# EAGLE design MaxAir Smart Home Gateway WT21-ET01 - v092 (EAGLE 9.6.2)
PiHome - Smart Heating, Ventilation and Air Conditioning (HVAC) Wi-Fi Smart Home Gateway based on MySensors library with NodeMCU and nRF24L01 PA LNA Note: Power by micro USB with minimum 2amp for better performance. For more information on PiHome Smart Heating: http://www.pihome.eu
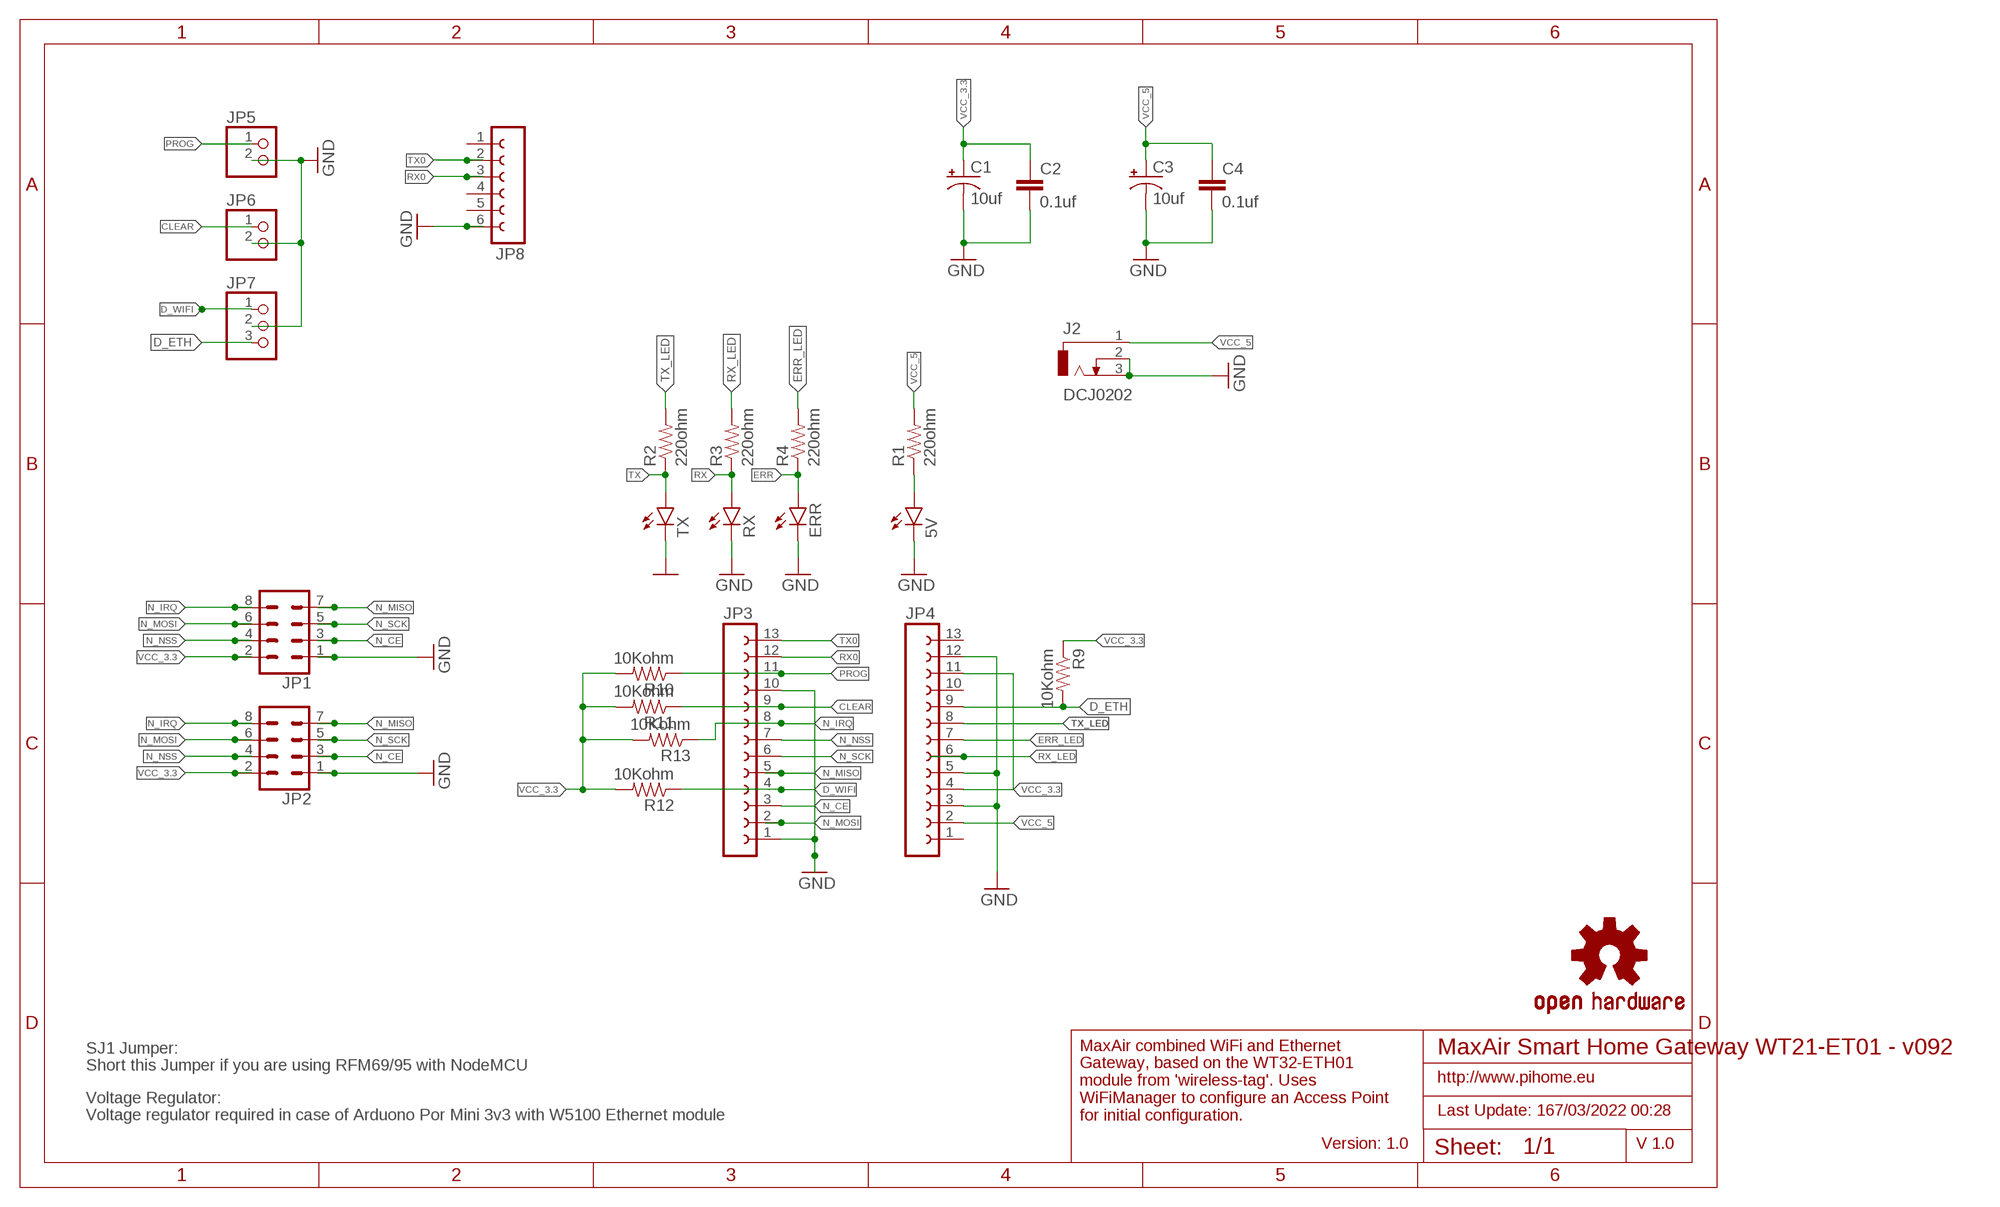
[diagram p0: schematic, sheet 1]

## Parts
5V  LED3MM  [LED3MM]
C1  10uf  10UF-25V-20%(PTH)KIT  [CPOL-RADIAL-10UF-25V-KIT]
C2  0.1uf  0.1UF-50V-20%(PTH)KIT-EZ  [CAP-PTH-SMALL-KIT]
C3  10uf  10UF-25V-20%(PTH)KIT  [CPOL-RADIAL-10UF-25V-KIT]
C4  0.1uf  0.1UF-50V-20%(PTH)KIT-EZ  [CAP-PTH-SMALL-KIT]
ERR  LED3MM  [LED3MM]
J2  DCJ0202  [DCJ0202]
JP1  CONN_04X2  [2X4]
JP2  CONN_04X2  [2X4]
JP3  FE13-1  [FE13]
JP4  FE13-1  [FE13]
JP5  PINHD-1X2  [1X02]
JP6  PINHD-1X2  [1X02]
JP7  PINHD-1X3  [1X03]
JP8  FE06-1  [FE06]
LOGO1  OSHW-LOGOMINI  [OSHW-LOGO-MINI]
R1  220ohm  RESISTORAXIAL-0.3  [AXIAL-0.3]
R2  220ohm  RESISTORAXIAL-0.3  [AXIAL-0.3]
R3  220ohm  RESISTORAXIAL-0.3  [AXIAL-0.3]
R4  220ohm  RESISTORAXIAL-0.3  [AXIAL-0.3]
R9  10Kohm  RESISTORAXIAL-0.3  [AXIAL-0.3]
R10  10Kohm  RESISTORAXIAL-0.3  [AXIAL-0.3]
R11  10Kohm  RESISTORAXIAL-0.3  [AXIAL-0.3]
R12  10Kohm  RESISTORAXIAL-0.3  [AXIAL-0.3]
R13  10Kohm  RESISTORAXIAL-0.3  [AXIAL-0.3]
RX  LED3MM  [LED3MM]
TX  LED3MM  [LED3MM]

## Nets
CLEAR: JP3.9 JP6.1 R11.P$1
D_ETH: JP4.9 JP7.3 R9.P$2
D_WIFI: JP3.4 JP7.1 R12.P$1
ERR: ERR.A R4.P$1
ERR_LED: JP4.7 R4.P$2
GND: 5V.K(C) C1.2(-) C2.2 C3.2(-) C4.2 ERR.K(C) J2.2 J2.3 JP1.1 JP2.1 JP3.1 JP3.10 JP4.3 JP4.5 JP4.12 JP5.2 JP6.2 JP7.2 JP8.6 RX.K(C) TX.K(C)
N$1: 5V.A R1.P$1
N_CE: JP1.3 JP2.3 JP3.3
N_IRQ: JP1.8 JP2.8 JP3.8 R13.P$1
N_MISO: JP1.7 JP2.7 JP3.5
N_MOSI: JP1.6 JP2.6 JP3.2
N_NSS: JP1.4 JP2.4 JP3.7
N_SCK: JP1.5 JP2.5 JP3.6
PROG: JP3.11 JP5.1 R10.P$1
RX: R3.P$1 RX.A
RX0: JP3.12 JP8.3
RX_LED: JP4.6 R3.P$2
TX: R2.P$1 TX.A
TX0: JP3.13 JP8.2
TX_LED: JP4.8 R2.P$2
VCC_3.3: C1.1(+) C2.1 JP1.2 JP2.2 JP4.4 JP4.11 R9.P$1 R10.P$2 R11.P$2 R12.P$2 R13.P$2
VCC_5: C3.1(+) C4.1 J2.1 JP4.2 R1.P$2
Unconnected: JP4.1 JP4.10 JP4.13 JP8.1 JP8.4 JP8.5

## Notes on the sheet
- SJ1 Jumper:
  Short this Jumper if you are using RFM69/95 with NodeMCU
- http://www.pihome.eu
- Last Update: 167/03/2022 00:28
- Voltage Regulator:
  Voltage regulator required in case of Arduono Por Mini 3v3 with W5100 Ethernet module
- MaxAir combined WiFi and Ethernet
  Gateway, based on the WT32-ETH01
  module from 'wireless-tag'. Uses
  WiFiManager to configure an Access Point
  for initial configuration.
- Version: 1.0 | V 1.0

## Library data of the parts
5V ERR RX TX = SparkFun-LED:LED: LEDs Standard schematic elements and footprints for 5mm, 3mm, 1206, and 0603 sized LEDs. 5mm - Spark Fun Electronics SKU : COM-00529 (and others); PROD_ID: DIO-08794
C1 C3 = SparkFun-Capacitors:10UF-25V-20%(PTH): CAP-08440; PROD_ID: CAP-08440
C2 C4 = SparkFun-Capacitors:0.1UF-50V-20%(PTH): CAP-08370; PROD_ID: CAP-08370
J2 = con-jack:DCJ0202: DC POWER JACK Source: DCJ0202.pdf; OC_FARNELL: unknown; OC_NEWARK: unknown
JP1 JP2 = SparkFun-Connectors:CONN_04X2: Multi connection point. Often used as Generic Header-pin footprint for 0.1 inch spaced/style header connections On any of the 0.1 inch spaced packages, you can populate with these: Break Away Headers - Straight <https://www.sparkfun.com/products/116> (PRT-00116) Break Away Male Headers - Right Angle <https://www.sparkfun.com/products/553> (PRT-00553) Female Headers <https://www.sparkfun.com/products/115> (PRT-00115) Break Away Headers - Machine Pin <https://www.sparkfun.com/products/117> (PRT-00117) Break Away Female Headers - Swiss Machine Pin <https://www.sparkfun.com/products/743> (PRT-00743)
JP3 JP4 = con-lsta:FE13-1: FEMALE HEADER; OC_FARNELL: unknown; OC_NEWARK: unknown
JP5 JP6 = pinhead:PINHD-1X2: PIN HEADER
JP7 = pinhead:PINHD-1X3: PIN HEADER
JP8 = con-lsta:FE06-1: FEMALE HEADER; OC_FARNELL: unknown; OC_NEWARK: unknown
LOGO1 = SparkFun-Aesthetics@1:OSHW-LOGO: Open-Source Hardware (OSHW) Logo This logo indicates the piece of hardware it is found on incorporates a OSHW license and/or adheres to the definition of open source hardware found here: http://freedomdefined.org/OSHW
R1-R4 R9-R13 = SparkFun-Passives:RESISTOR: Resistor Basic schematic elements and footprints for 0603, 1206, and PTH resistors.

## Net classes
0 default: width 0.254 mm, drill 0.076 mm, clearance 0.205 mm

## Board
PiHome - Smart Heating, Ventilation and Air Conditioning (HVAC) Wi-Fi Smart Home Gateway based on MySensors library with NodeMCU and nRF24L01 PA LNA Note: Power by micro USB with minimum 2amp for better performance. For more information on PiHome Smart Heating: http://www.pihome.eu
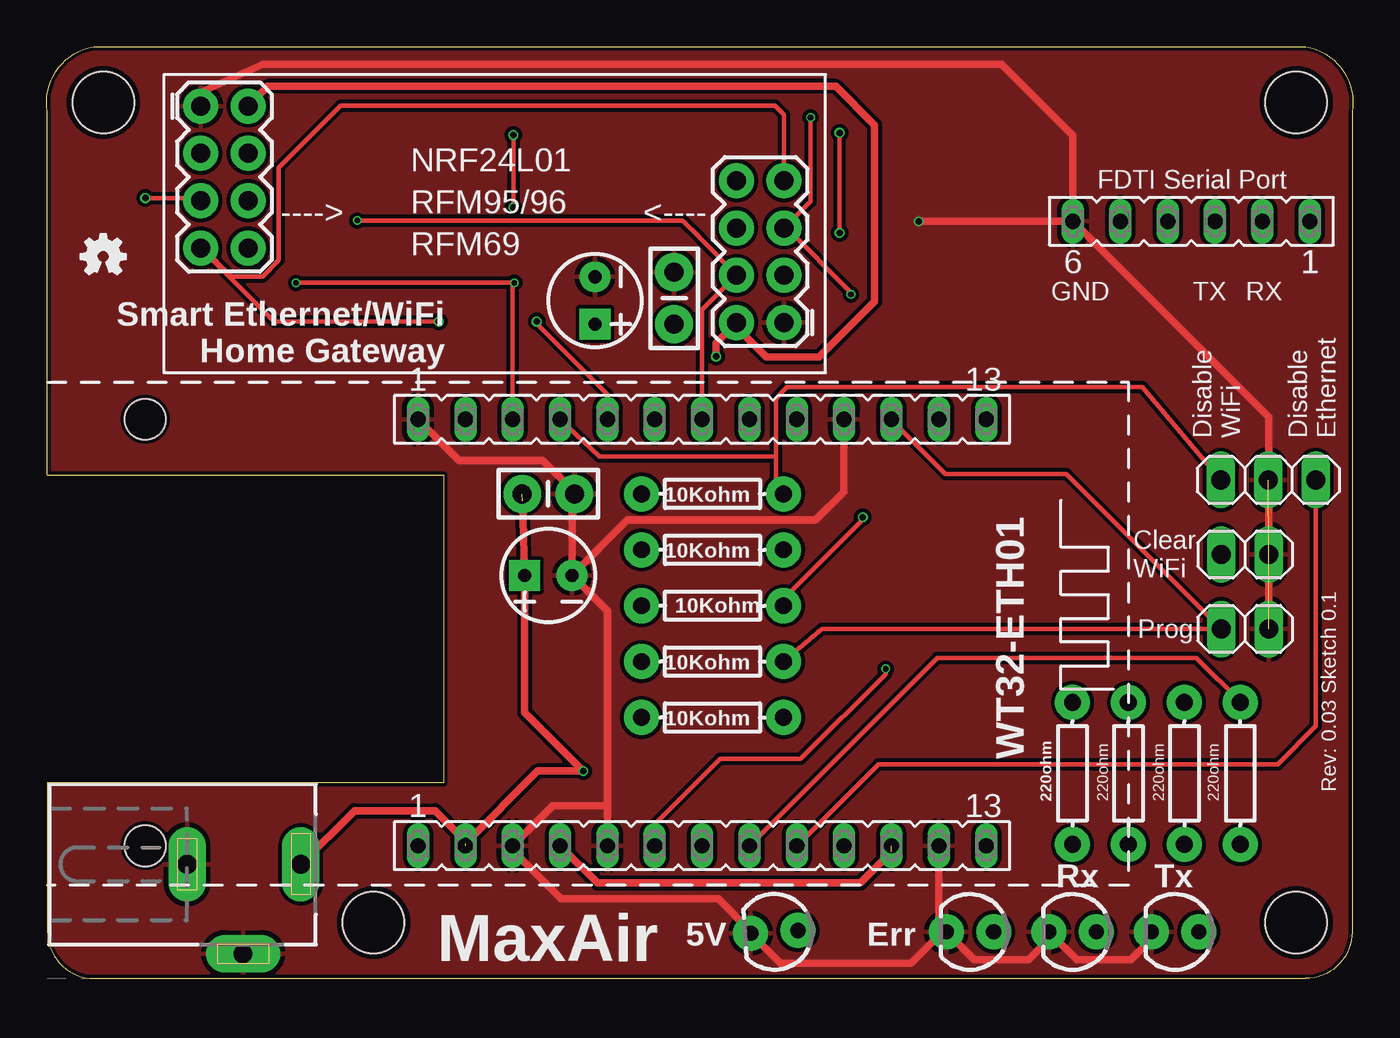
[diagram p1: board, top side]
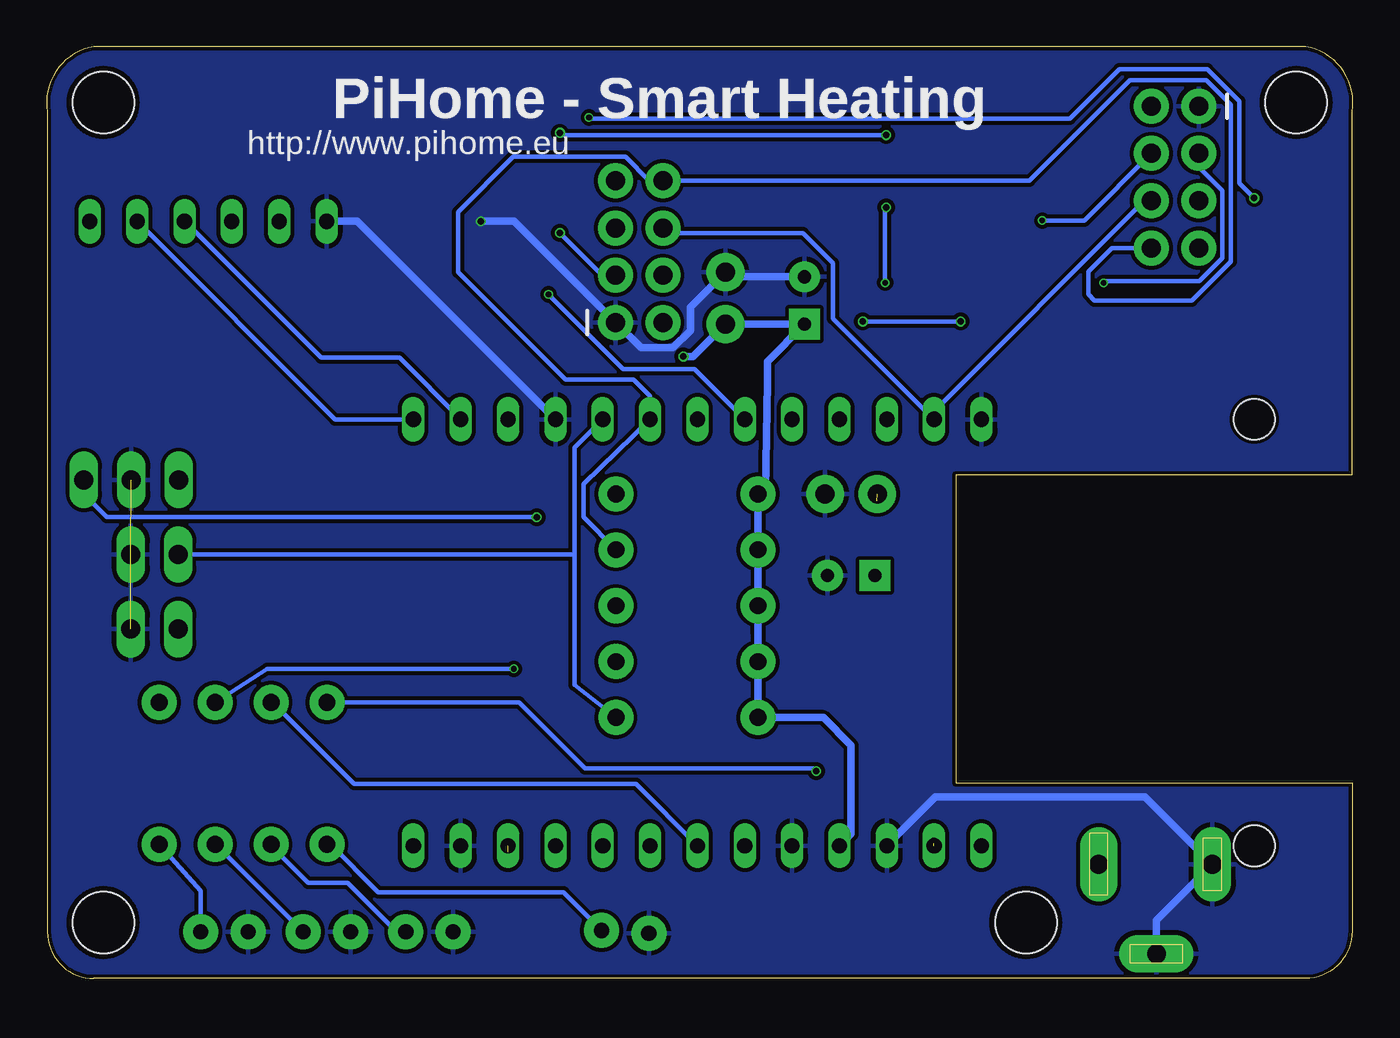
[diagram p2: board, bottom side, seen from below]

Size 70.08 x 50 mm. Coordinates in mm from the lower left corner, seen from the top.
Outline: 2.54,0 67.54,0 arc90 70.04,2.5 70.04,46.5 arc90 67.54,50 2.54,50 arc90 0.04,46.5 0.04,27 21.29,27 21.29,10.5 0.04,10.5 0.04,2.55 arc90 2.54,0
Copper layers (1*16): Top 0.035559375mm / dielectric 1.6mm / Bottom 0.035559375mm
Design rules "PiHome - JLCPCB 2 Layer": minimum track width 5mil, minimum drill 12mil, track to track 5mil, track to pad 5mil, pad to pad 5mil, via to via 5mil, smd to smd 5mil, copper to edge 8mil, drill to drill 6mil, minimum pad ring 5mil, minimum via ring 3mil, stop-mask expansion 2.5mil, vias tented up to drill 0mil, thermal gap 10mil
Holes 2.2 mm at 5.29,30 5.29,7.12

### Footprints (pad centres in the part's own frame; a part is rotated, then mirrored left to right if it is on the bottom)
LED3MM = drill 0.813 pad 1.88: A -1.27,0; K 1.27,0
CPOL-RADIAL-10UF-25V-KIT = drill 0.7 pad 1.651 square: 1 1.27,0 | drill 0.7 pad 1.651: 2 -1.27,0
CAP-PTH-SMALL-KIT = drill 1.016 pad 2.032: 1 -1.397,0; 2 1.397,0
DCJ0202 = drill 1 pad 2 long: 1 0,3.1; 2 4.8,0; 3 0,-3
2X4 = drill 1.016 pad 1.88: 1 -3.81,-1.27; 2 -3.81,1.27; 3 -1.27,-1.27; 4 -1.27,1.27; 5 1.27,-1.27; 6 1.27,1.27; 7 3.81,-1.27; 8 3.81,1.27
FE13 = drill 0.813 long: 1 -15.24,0; 2 -12.7,0; 3 -10.16,0; 4 -7.62,0; 5 -5.08,0; 6 -2.54,0; 7 0,0; 8 2.54,0; 9 5.08,0; 10 7.62,0; 11 10.16,0; 12 12.7,0; 13 15.24,0
1X02 = drill 1.016 long: 1 -1.27,0; 2 1.27,0
1X03 = drill 1.016 long: 1 -2.54,0; 2 0,0; 3 2.54,0
FE06 = drill 0.813 long: 1 -6.35,0; 2 -3.81,0; 3 -1.27,0; 4 1.27,0; 5 3.81,0; 6 6.35,0
AXIAL-0.3 = drill 0.9 pad 1.88: P$1 -3.81,0; P$2 3.81,0
STAND-OFF = hole 3.302: 0,0

### Placement (x,y rotation side)
5V  39.04,2.5 183.3 top
C1  29.42,36.38 270 top
C2  33.67,36.5 90 top
C3  26.92,21.62 180 top
C4  26.92,26 0 top
ERR  49.54,2.5 180 top
J2  10.54,6.12 270 top
JP1  38.29,39 90 top
JP2  9.54,43 270 top
JP3  35.17,30 0 top
JP4  35.17,7.12 0 top
JP5  64.29,18.75 0 top
JP6  64.29,22.75 0 top
JP7  65.54,26.75 0 top
JP8  61.42,40.62 180 top
LOGO1  3.04,38.75 0 top
R1  55.04,11 90 top
R2  64.04,11 90 top
R3  61.04,11 90 top
R4  58.04,11 90 top
R9  35.73,20 0 top
R10  35.73,17 180 top
R11  35.73,14 180 top
R12  35.73,26 180 top
R13  35.73,23 180 top
RX  55.04,2.5 180 top
TX  60.54,2.5 180 top
U$1  [STAND-OFF]  3.04,47 0 top
U$2  [STAND-OFF]  17.54,3 0 top
U$4  [STAND-OFF]  67.04,47 0 top
U$5  [STAND-OFF]  67.04,3 0 top

### Tracks (layer width: path | path; a pad name or v marks a point on that pad's centre or on a via)
CLEAR
  Bottom 0.254: JP6.1 43.32,22.75 | 43.32,22.75 | 41.75,22.75 41.75,26.36 41.75,26.55 41.75,28.5 JP3.9 | 41.75,22.75 41.75,15.75 R11.P$1 | 43.32,22.75 41.75,22.75
D_ETH  (via drill 0.35)
  Top 0.254: v43.79,24.75 43.79,24.62 39.54,20.37 R9.P$2 | JP4.9 44.62,11.5 66.04,11.5 68.08,13.54 JP7.3 68.17,26.66
  Bottom 0.254: v43.79,24.75 43.81,24.77 66.87,24.77 68.08,25.98 JP7.3
D_WIFI
  Top 0.254: 39.12,28 39.12,31.11 39.73,31.73 58.79,31.73 JP7.1 | 39.12,28 39.12,26.61 R12.P$1 | JP3.4 29.67,28 39.12,28
ERR
  Bottom 0.254: ERR.A 51.31,2.5 53.94,5.12 56.04,5.12 58.01,7.1 R4.P$1
ERR_LED
  Bottom 0.254: JP4.7 38.47,10.43 53.59,10.43 57.96,14.81 R4.P$2
GND  (via drill 0.35)  (2 unrouted)
  Top 0.406: JP2.1 8.27,47.56 11.63,49.06 51.23,49.06 55.07,45.23 55.07,40.88 | C3.2 28.19,25.63 C4.2 28.31,26.09 26.61,27.8 22.13,27.8 JP3.1 | C3.2 31.15,24.59 41.26,24.59 42.79,26.11 JP3.10 | JP4.5 30.09,9.25 | 30.09,9.25 30.09,19.73 C3.2 | 55.07,40.88 JP8.6 65.56,30.13 JP5.2 | ERR.K 48.27,2.71 46.38,0.82 39.38,0.82 5V.K 37.77,2.54 36.05,4.26 27.61,4.26 25.01,6.87 JP4.3 27.13,9.25 30.09,9.25 | JP4.12 47.87,2.9 ERR.K | v46.79,40.62 54.82,40.62 55.07,40.88 | ERR.K 49.77,1 52.67,1 53.77,2.1 RX.K 55.27,1 58.17,1 59.27,2.1 TX.K
  Bottom 0.406: v46.79,40.62 45,40.62 JP1.1 38.2,33.84 36.46,33.84 35.55,34.76 35.55,36.02 C2.2 33.41,37.65 C1.2 | JP4.3 25.01,7.13 22.39,9.75 11.17,9.75 J2.3 10.54,3.12 J2.2 | JP3.10 53.41,40.62 JP8.6
  pour Top: 0.29,0.25 0.29,10.25 21.54,10.25 21.54,27.25 0.29,27.25 0.29,49.75 69.79,49.75 69.79,0.25
  pour Bottom: 0.29,0.25 69.79,0.25 69.79,49.75 0.29,49.75 0.29,27.25 21.54,27.25 21.54,10.25 0.29,10.25
N$1
  Bottom 0.254: 5V.A 42.36,4.62 52.29,4.62 54.85,7.19 R1.P$1
N_CE  (via drill 0.3, 0.35)
  Top 0.254: v25.1,37.33 | v25.1,37.33 13.64,37.33 v13.38,37.32 | JP3.3 25.01,37.24 v25.1,37.33 | v25.04,41.38 v25.04,45.25 | v42.54,45.38 v42.54,40
  Bottom 0.254: v13.38,37.32 13.28,37.42 8.24,37.42 7,38.66 7,42.26 8.27,43.53 JP2.3 | v25.1,37.33 25.1,41.32 v25.04,41.38 | v42.54,45.38 42.42,45.25 v25.04,45.25 | v42.54,40 40.27,37.73 JP1.3
N_IRQ
  Bottom 0.254: R13.P$1 41.29,24.77 41.29,26.54 JP3.8 37.71,31.25 38.58,32.12 42.24,32.12 48.01,37.89 48.01,41.12 45.05,44.08 39.03,44.08 37.76,42.81 JP1.8 17.36,42.81 11.96,48.21 7.87,48.21 6.54,46.88 6.54,38.47 8.63,36.38 13.86,36.38 14.19,36.71 14.19,37.92 12.92,39.19 JP2.8
N_MISO  (via drill 0.35)
  Top 0.254: JP1.7 39.56,46.35 39.09,46.83 15.78,46.83 12.46,43.51 12.46,38.54 11.59,37.67 9.91,37.67 8.39,39.19 JP2.7 12.21,35.25 v21.04,35.25 | v26.29,35.25 26.29,35.12 30.09,31.33 JP3.5
  Bottom 0.254: v21.04,35.25 v26.29,35.25
N_MOSI
  Bottom 0.254: JP3.2 22.49,30.23 22.59,30.32 11.19,41.73 JP2.6 | JP3.2 22.47,30.48 | JP1.6 36.75,40 29.51,40 27.88,38.37 27.88,35.42 JP3.2
N_NSS  (via drill 0.3)
  Top 0.254: 35.23,30.23 JP3.7 35.17,35.88 JP1.4 35.04,39.71 35.04,39.75 34.12,40.67 v16.67,40.67
  Bottom 0.254: v16.67,40.67 14.41,40.67 JP2.4
N_SCK  (via drill 0.3, 0.35)
  Top 0.254: v5.29,41.88 8.13,41.88 JP2.5 | v40.98,46.2 40.98,41.69 39.63,40.34 43.15,36.81 v43.15,36.7 | 39.6,40.31 JP1.5
  Bottom 0.254: v40.98,46.2 40.91,46.13 15.19,46.13 12.53,48.79 7.8,48.79 6.08,47.07 6.08,42.66 v5.29,41.88 | JP3.6 35.33,32.7 39.15,32.7 v43.15,36.7
PROG
  Top 0.254: 45.38,30.01 JP3.11 45.33,29.97 48.23,27.07 54.7,27.07 JP5.1 41.59,18.75 R10.P$1
RX
  Bottom 0.254: R3.P$1 60.04,6.23 RX.A
RX0
  Bottom 0.254: JP3.12 47.87,30.03 51.14,33.3 55.36,33.3 JP8.3
RX_LED  (via drill 0.3)
  Top 0.254: v45.02,16.61 45.02,16.34 40.45,11.77 36.12,11.77 32.63,8.28 JP4.6
  Bottom 0.254: v45.02,16.61 58.24,16.61 R3.P$2
TX
  Bottom 0.254: TX.A 61.81,4.71 R2.P$1
TX0
  Bottom 0.254: JP8.2 54.6,30 JP3.13
TX_LED
  Top 0.254: R2.P$2 64.08,14.82 61.69,17.21 47.79,17.21 JP4.8
VCC_3.3  (via drill 0.35)  (1 unrouted)
  Top 0.406: 45.33,6.79 43.67,5.12 29.55,5.12 JP4.4 | JP2.2 11.86,47.86 42.35,47.86 44.41,45.8 44.41,36.31 41.44,33.34 38.63,33.34 37.02,34.95 JP1.2 35.92,34.09 v35.92,33.38
  Bottom 0.406: R9.P$1 R13.P$2 R12.P$2 31.52,26.18 31.42,32 31.42,33.1 C1.1 C2.1 35.39,33.38 v35.92,33.38 | 31.92,18.57 R9.P$1 | R9.P$1 R10.P$2 R11.P$2 28.42,14 26.92,12.51 26.92,7.75 JP4.4
VCC_5  (via drill 0.35, 0.6)  (2 unrouted)
  Top 0.406: 25.53,25.62 25.64,21.76 C3.1 25.65,14.27 v28.79,11.12 26.35,11.12 v22.47,7.25 | JP4.2 22.63,7.29 22.56,7.29 20.85,9 16.52,9 J2.1
  Bottom 0.254: v28.79,11.12 28.93,11.27 41.19,11.27 44.73,14.81 R1.P$2

### Text on the board
tPlace: NRF24L01 | RFM95/96 | ----> | <---- | RFM69 | Smart Ethernet/WiFi / Home Gateway | Disable / WiFi | Disable / Ethernet | Clear / WiFi | Prog | WT32-ETH01 | Rev: 0.03 Sketch 0.1 | Rx | Tx | 5V | Err | MaxAir
bPlace: PiHome - Smart Heating | http://www.pihome.eu
tNames: FDTI Serial Port | GND | TX | RX
tValues: 0.1uf | 0.1uf